# Altium schematic sheet HUB V1.3B.240322_TG.SchDoc
size A3
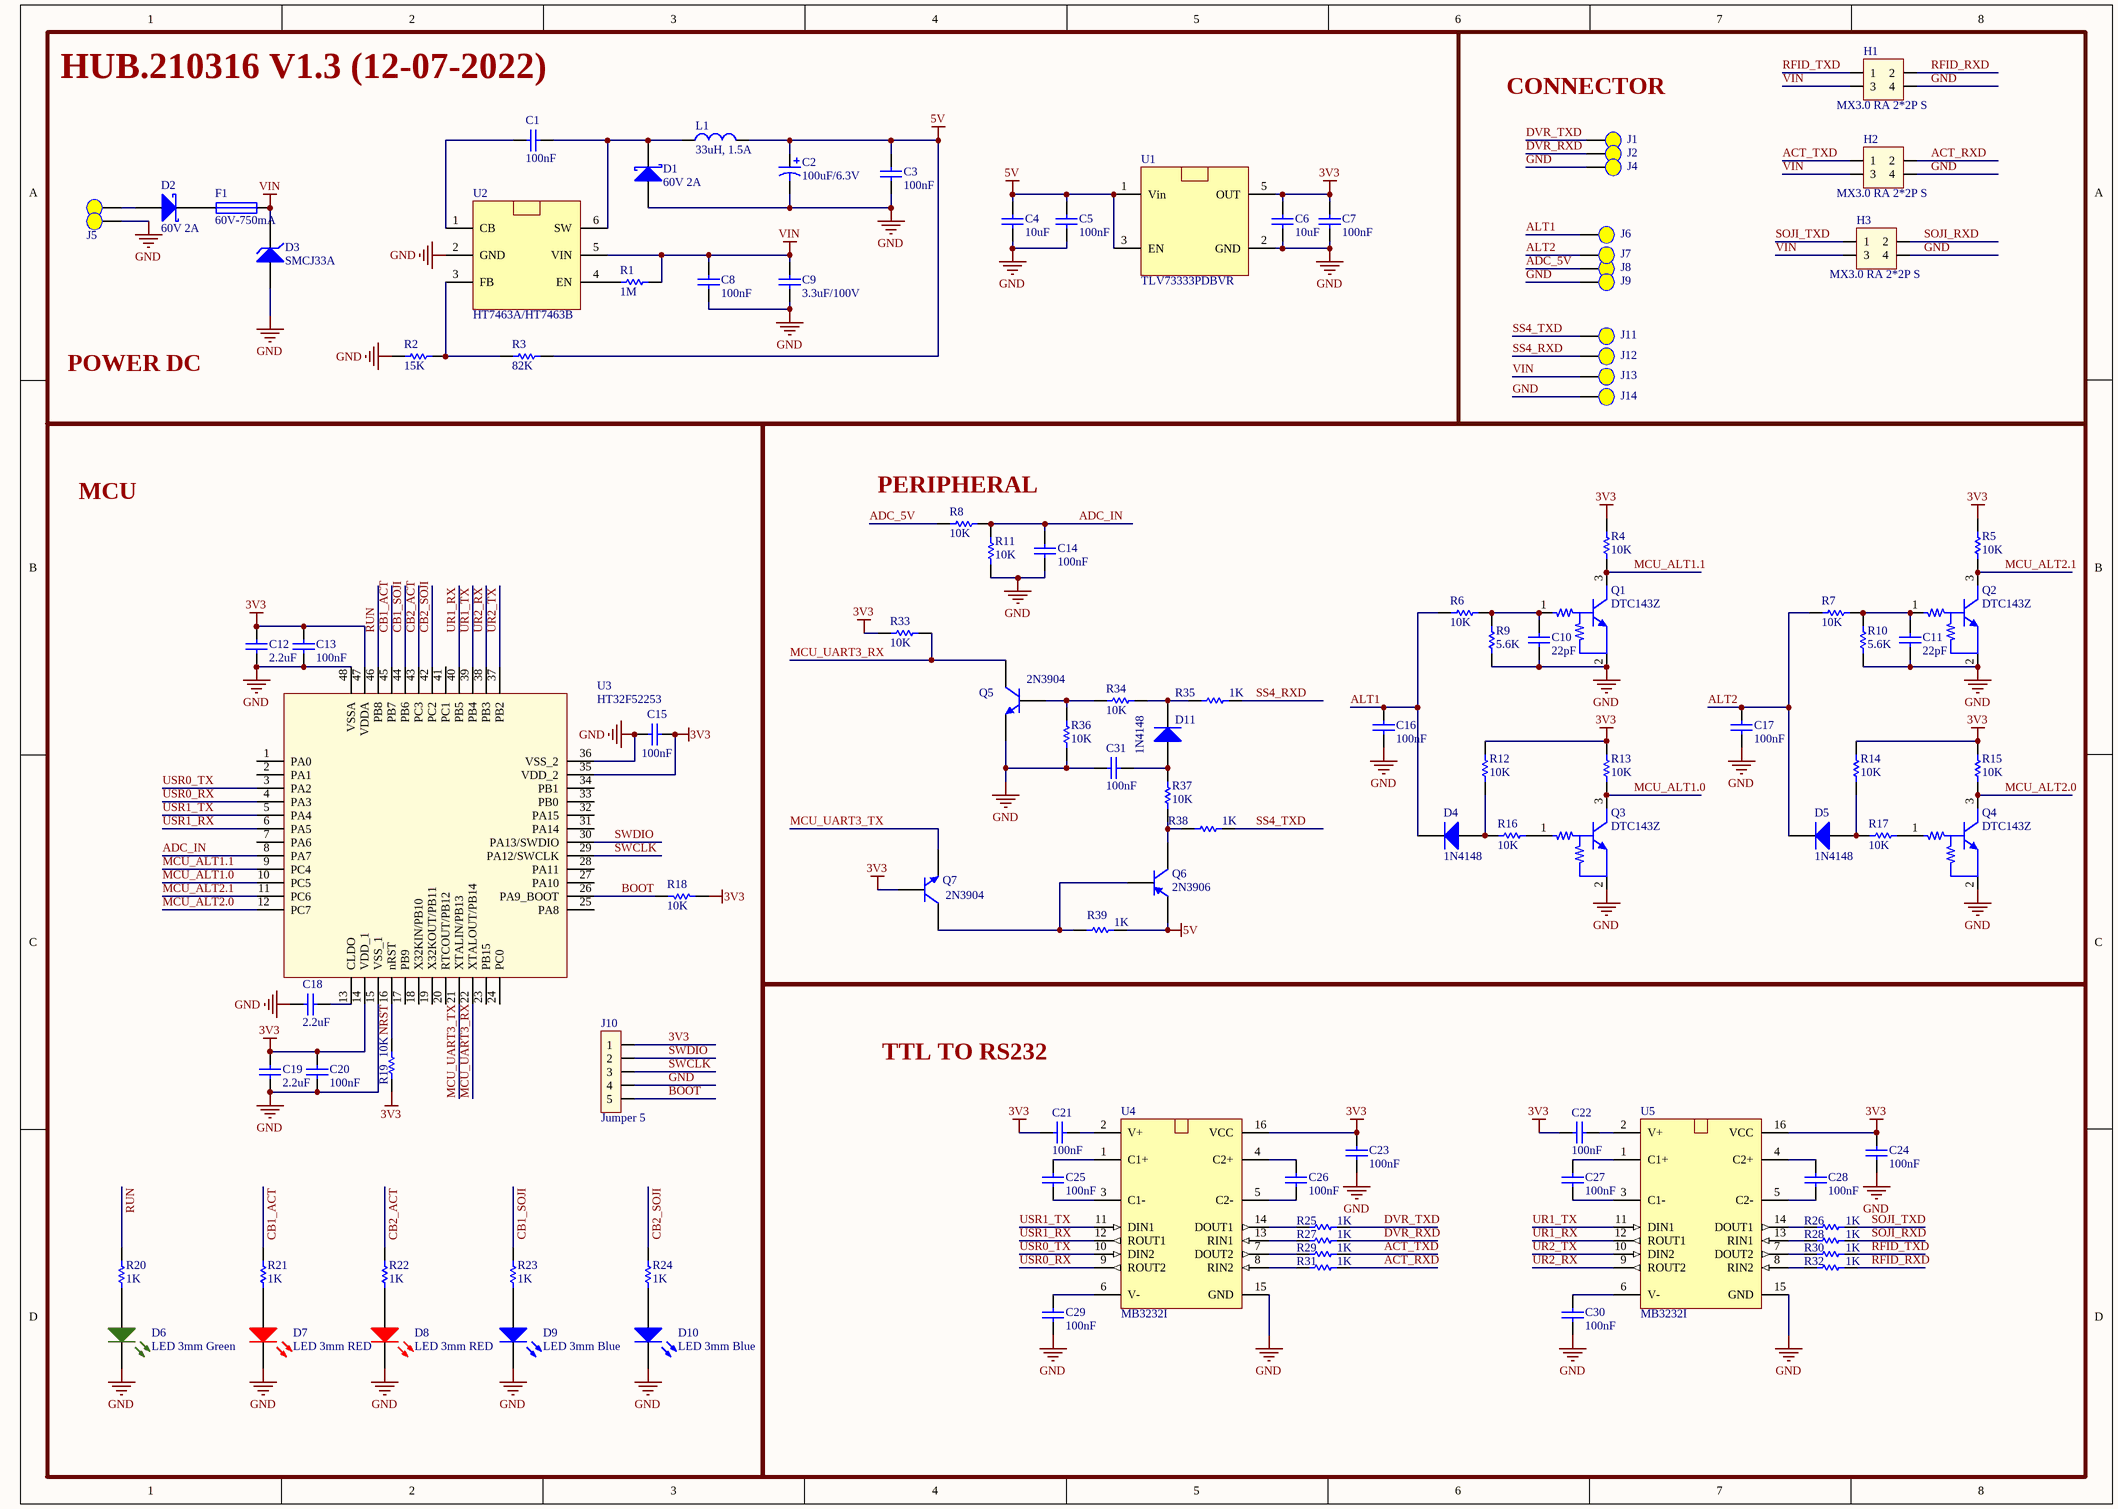
[diagram p0: HUB V1.3B.240322_TG.SchDoc]

## Parts
C1  100nF  [0603 - C]
C2  value 100uF/6.3V  [3528 - TANTALUM]  (hidden comment: 107B)
C3  100nF  [0603 - C]
C4  10uF  [0603 - C]
C5  100nF  [0603 - C]
C6  10uF  [0603 - C]
C7  100nF  [0603 - C]
C8  100nF  [0603 - C]
C9  3.3uF/100V  [1210 - C]
C10  22pF  [0603 - C]
C11  22pF  [0603 - C]
C12  2.2uF  [0603 - C]
C13  100nF  [0603 - C]
C14  100nF  [0603 - C]
C15  100nF  [0603 - C]
C16  100nF  [0603 - C]
C17  100nF  [0603 - C]
C18  2.2uF  [0603 - C]
C19  2.2uF  [0603 - C]
C20  100nF  [0603 - C]
C21  100nF  [0603 - C]
C22  100nF  [0603 - C]
C23  100nF  [0603 - C]
C24  100nF  [0603 - C]
C25  100nF  [0603 - C]
C26  100nF  [0603 - C]
C27  100nF  [0603 - C]
C28  100nF  [0603 - C]
C29  100nF  [0603 - C]
C30  100nF  [0603 - C]
C31  100nF  [0603 - C]
D1  60V 2A  [SOD-123]
D2  60V 2A  [SOD-123]
D3  SMCJ33A  [DIODE - SMC]
D4  1N4148  [SOD-123]
D5  1N4148  [SOD-123]
D6  LED 3mm Green  [LED-3mm GREEN]
D7  LED 3mm RED  [LED-3mm RED]
D8  LED 3mm RED  [LED-3mm RED]
D9  LED 3mm Blue  [LED-3mm BLUE]
D10  LED 3mm Blue  [LED-3mm BLUE]
D11  1N4148  [SOD-123]
F1  60V-750mA  [2016 - Fuse]
H1  MX3.0 RA 2*2P S  [43045-M3045-2x2-B]
H2  MX3.0 RA 2*2P S  [43045-M3045-2x2-B]
H3  MX3.0 RA 2*2P S  [43045-M3045-2x2-B]
J1  Test Point  [TP1]  (value not drawn)
J2  Test Point  [TP1]  (value not drawn)
J3  Test Point  [TP1]  (value not drawn)
J4  Test Point  [TP1]  (value not drawn)
J5  Test Point  [TP1]  (value not drawn)
J6  Test Point  [TP1]  (value not drawn)
J7  Test Point  [TP1]  (value not drawn)
J8  Test Point  [TP1]  (value not drawn)
J9  Test Point  [TP1]  (value not drawn)
J10  Jumper 5  [JP5 - 1]
J11  Test Point  [TP1]  (value not drawn)
J12  Test Point  [TP1]  (value not drawn)
J13  Test Point  [TP1]  (value not drawn)
J14  Test Point  [TP1]  (value not drawn)
L1  33uH, 1.5A  [INDUCTOR-5D28]
Q1  DTC143Z  [SOT23B]
Q2  DTC143Z  [SOT23B]
Q3  DTC143Z  [SOT23B]
Q4  DTC143Z  [SOT23B]
Q5  2N3904  [SOT23B]
Q6  2N3906  [SOT23B]
Q7  2N3904  [SOT23B]
R1  1M  [0603 - R]
R2  15K  [0603 - R]
R3  82K  [0603 - R]
R4  10K  [0603 - R]
R5  10K  [0603 - R]
R6  10K  [0603 - R]
R7  10K  [0603 - R]
R8  10K  [0603 - R]
R9  5.6K  [0603 - R]
R10  5.6K  [0603 - R]
R11  10K  [0603 - R]
R12  10K  [0603 - R]
R13  10K  [0603 - R]
R14  10K  [0603 - R]
R15  10K  [0603 - R]
R16  10K  [0603 - R]
R17  10K  [0603 - R]
R18  10K  [0603 - R]
R19  10K  [0603 - R]
R20  1K  [0603 - R]
R21  1K  [0603 - R]
R22  1K  [0603 - R]
R23  1K  [0603 - R]
R24  1K  [0603 - R]
R25  1K  [0603 - R]
R26  1K  [0603 - R]
R27  1K  [0603 - R]
R28  1K  [0603 - R]
R29  1K  [0603 - R]
R30  1K  [0603 - R]
R31  1K  [0603 - R]
R32  1K  [0603 - R]
R33  10K  [0603 - R]
R34  10K  [0603 - R]
R35  1K  [0603 - R]
R36  10K  [0603 - R]
R37  10K  [0603 - R]
R38  1K  [0603 - R]
R39  1K  [0603 - R]
U1  TLV73333PDBVR  [SOT23-5]
U2  HT7463A/HT7463B  [SOT23-6_L]
U3  HT32F52253  [LQFP48]
U4  MB3232I  [TSSOP16]
U5  MB3232I  [TSSOP16]

## Blocks framed on the sheet
HUB.210316 V1.3 (12-07-2022): C1-C9 D1-D3 F1 J3 J5 L1 R1-R3 U1 U2
CONNECTOR: H1-H3 J1 J2 J4 J6-J9 J11-J14
MCU: C12 C13 C15 C18-C20 D6-D10 J10 R18-R24 U3
PERIPHERAL: C10 C11 C14 C16 C17 C31 D4 D5 D11 Q1-Q7 R4-R17 R33-R39
TTL TO RS232: C21-C30 R25-R32 U4 U5

## Nets
3V3: C6.2 C7.2 C12.2 C13.1 C15.2 C19.2 C20.1 C21.2 C22.2 C23.1 C24.1 J10.1 Q7.1(B) R4.2 R5.2 R12.2 R13.2 R14.2 R15.2 R18.1 R19.1 R33.2 U1.5(OUT) U3.14(VDD_1) U3.35(VDD_2) U3.47(VDDA) U4.16(VCC) U5.16(VCC)
5V: C2.1 C3.2 C4.2 C5.2 L1.2 Q6.2(E) R3.2 R39.2 U1.1(Vin) U1.3(EN)
GND: C2.2 C3.1 C4.1 C5.1 C6.1 C7.1 C8.1 C9.1 C10.1 C11.1 C12.1 C13.2 C14.1 C15.1 C16.1 C17.1 C18.2 C19.1 C20.2 C23.2 C24.2 C29.2 C30.2 C31.1 D1.1(A) D3.1(A) D6.2(K) D7.2(K) D8.2(K) D9.2(K) D10.2(K) H1.4 H2.4 H3.4 J4.1 J5.1 J9.1 J10.4 J14.1 Q1.2(GND) Q2.2(GND) Q3.2(GND) Q4.2(GND) Q5.2(E) R2.2 R9.1 R10.1 R11.1 R36.2 U1.2(GND) U2.2(GND) U3.15(VSS_1) U3.36(VSS_2) U3.48(VSSA) U4.15(GND) U5.15(GND)
VIN: C8.2 C9.2 D3.2(K) F1.2 H1.3 H2.3 H3.3 J13.1 R1.1 U2.5(VIN)
ACT_RXD: H2.2 R29.2
ACT_TXD: H2.1 R27.2
ADC_5V: J8.1 R8.2
ADC_IN: C14.2 R8.1 R11.2 U3.8(PA7)
ALT1: C16.2 D4.2(K) J6.1 R6.1
ALT2: C17.2 D5.2(K) J7.1 R7.1
BOOT: J10.5 R18.2 U3.26(PA9_BOOT)
CB1_ACT: R21.1 U3.45(PB7)
CB1_SOJI: R23.1 U3.44(PB6)
CB2_ACT: R22.1 U3.43(PC3)
CB2_SOJI: R24.1 U3.42(PC2)
DVR_RXD: J2.1 R31.2
DVR_TXD: J1.1 R25.2
MCU_ALT1.0: Q3.3(OUT) R13.1 U3.10(PC5)
MCU_ALT1.1: Q1.3(OUT) R4.1 U3.9(PC4)
MCU_ALT2.0: Q4.3(OUT) R15.1 U3.12(PC7)
MCU_ALT2.1: Q2.3(OUT) R5.1 U3.11(PC6)
MCU_UART3_RX: Q5.3(C) R33.1 U3.22(XTALOUT/PB14)
MCU_UART3_TX: Q7.2(E) U3.21(XTALIN/PB13)
NRST: R19.2 U3.16(nRST)
RFID_RXD: H1.2 R32.2
RFID_TXD: H1.1 R30.2
RUN: R20.1 U3.46(PB8)
SOJI_RXD: H3.2 R28.2
SOJI_TXD: H3.1 R26.2
SS4_RXD: J12.1 R35.2
SS4_TXD: J11.1 R38.2
SWCLK: J10.3 U3.29(PA12/SWCLK)
SWDIO: J10.2 U3.30(PA13/SWDIO)
UR1_RX: U3.40(PB5) U5.12(ROUT1)
UR1_TX: U3.39(PB4) U5.11(DIN1)
UR2_RX: U3.38(PB3) U5.9(ROUT2)
UR2_TX: U3.37(PB2) U5.10(DIN2)
USR0_RX: U3.4(PA3) U4.9(ROUT2)
USR0_TX: U3.3(PA2) U4.10(DIN2)
USR1_RX: U3.6(PA5) U4.12(ROUT1)
USR1_TX: U3.5(PA4) U4.11(DIN1)
NetC1_1: C1.1 U2.1(CB)
NetC1_2: C1.2 D1.2(K) L1.1 U2.6(SW)
NetC10_2: C10.2 Q1.1(IN) R6.2 R9.2
NetC11_2: C11.2 Q2.1(IN) R7.2 R10.2
NetC18_1: C18.1 U3.13(CLDO)
NetC21_1: C21.1 U4.2(V+)
NetC22_1: C22.1 U5.2(V+)
NetC25_1: C25.1 U4.1(C1+)
NetC25_2: C25.2 U4.3(C1-)
NetC26_1: C26.1 U4.4(C2+)
NetC26_2: C26.2 U4.5(C2-)
NetC27_1: C27.1 U5.1(C1+)
NetC27_2: C27.2 U5.3(C1-)
NetC28_1: C28.1 U5.4(C2+)
NetC28_2: C28.2 U5.5(C2-)
NetC29_1: C29.1 U4.6(V-)
NetC30_1: C30.1 U5.6(V-)
NetC31_2: C31.2 D11.1(A) R37.1
NetD2_1: D2.1(A) J3.1
NetD2_2: D2.2(K) F1.1
NetD4_1: D4.1(A) R12.1 R16.2
NetD5_1: D5.1(A) R14.1 R17.2
NetD6_1: D6.1(A) R20.2
NetD7_1: D7.1(A) R21.2
NetD8_1: D8.1(A) R22.2
NetD9_1: D9.1(A) R23.2
NetD10_1: D10.1(A) R24.2
NetD11_2: D11.2(K) R34.1 R35.1
NetQ3_1: Q3.1(IN) R16.1
NetQ4_1: Q4.1(IN) R17.1
NetQ5_1: Q5.1(B) R34.2 R36.1
NetQ6_1: Q6.1(B) Q7.3(C) R39.1
NetQ6_3: Q6.3(C) R37.2 R38.1
NetR1_2: R1.2 U2.4(EN)
NetR2_1: R2.1 R3.1 U2.3(FB)
NetR25_1: R25.1 U4.14(DOUT1)
NetR26_1: R26.1 U5.14(DOUT1)
NetR27_1: R27.1 U4.7(DOUT2)
NetR28_1: R28.1 U5.13(RIN1)
NetR29_1: R29.1 U4.8(RIN2)
NetR30_1: R30.1 U5.7(DOUT2)
NetR31_1: R31.1 U4.13(RIN1)
NetR32_1: R32.1 U5.8(RIN2)

Not connected (* = marked no-connect by the designer): U1 4(NC); U3 1(PA0) 2(PA1) 7(PA6) 17(PB9) 18(X32KIN/PB10) 19(X32KOUT/PB11) 20(RTCOUT/PB12) 23(PB15) 24(PC0) 25(PA8) 27(PA10) 28(PA11) 31(PA14) 32(PA15) 33(PB0) 34(PB1) 41(PC1)

## Notes on the sheet
- POWER DC

## Library data of the parts
C1 C3 C8 C13 C15-C17 C20-C30 = Cap 0603 100nF: CAP CER 100nF 50V C0G/NP0 0603; MPN: CL10C104JB8NNNC; MFR: SAMSUNG; Company ID: VT_TỤ ĐIỆN_C0603 100nF; Voltage: 50V; Package: 0603; Size: C0603: 100nF; Value: 100nF
C2 = Cap Tan 3528 100uF/6.3V: CAP TANT 100UF 6.3V 10% 1411; MPN: T491B107K006AT; MFR: Kemet; Company ID: VT_CAP TAN 100uF 6.3V
C4 C6 = Cap 0603 10uF: CAP CER 10UF 16V X5R 0603; MPN: EMK107BBJ106MA-T; MFR: Yageo; Company ID: VT_CAP_C0603 10uF; Size: C0603: 10uF; Package: 0603; Value: 10uF
C5 C7 C14 C31 = Cap 0603 100nF: CAP CER 100nF 50V C0G/NP0 0603; MPN: CL10C104JB8NNNC; MFR: SAMSUNG; Company ID: VT_CAP_C0603 100nF; Voltage: 50V; Package: 0603; Size: C0603: 100nF; Value: 100nF
C9 = Cap 1210 3.3uF: CAP CER 3.3UF 100V X7S 1210; MPN: C3225X7S2A335M200AB; MFR: TDK Corporation; Company ID: VT_CAP_C1210 3.3uF 100V; Size: C1210: 3.3uF/100V; MPN2: 885012209071; Value: 3.3uF/100V
C10 C11 = Cap 0603 22pF: CAP CER 22PF 50V C0G/NP0 0603; MPN: CL10C220JB8NNNC; MFR: SAMSUNG; Company ID: VT_TỤ ĐIỆN_C0603 22pF; Size: C0603: 22pF; Value: 22pF
C12 C18 C19 = Cap 0603 2.2uF: CAP CER 2.2UF 50V X5R 0603; MFR: Murata Electronics; MPN: GRM188R61H225KE11J; Company ID: VT_CAP_C0603 2.2uF; Size: C0603: 2.2uF; Value: 2.2uF
D1 D2 = Diode PMEG6020ER: DIODE SCHOTTKY 60V 2A SOD123W; MPN: PMEG6020ER,115; MFR: NXP; Company ID: VT_DIODE_PMEG6020ER
D3 = SMCJ33A: TVS DIODE 33V 36.7V; MFR: Bourns Inc.; MPN: SMCJ33ABTR-ND; Company ID: VT_DIODE_ SMCJ33
D4 D5 D11 = Diode 1N4148: DIODE GEN PURP 100V 300MA SOD123; MPN: 1N4148W-7-F; MFR: DIODES; Company ID: VT_DIODE_1N4148W-7-F
D6 = LED 3mm Green: MFR: xx; Company ID: VT_LED_3mm_Green; MPN: xx
D7 D8 = LED 3mm RED: MFR: xx; Company ID: VT_LED_3mm_RED; MPN: xx
D9 D10 = LED 3mm Blue: MFR: China; MPN: xx; Company ID: VT_LED_3mm_Blue
F1 = Fuse 60V - 750mA: PTC RESET FUSE 60V 750MA 2016; MFR: Littelfuse Inc.; MPN: 2016L075/60MR; Company ID: VT_Fuse_60V - 750mA
H1-H3 = HD2x2 S: Micro-Fit 3.0™ Straight Header, 3.00mm Pitch, Dual Row, 4 Circuits; MPN: M3045-2x2-B; MFR: China; Company ID: VT_CONN_2*2 (M3045); MPN2: 43045-
J1-J9 J11-J14 = TP: 1mm - 1 layer
J10 = JP5: Jumper 5, 2.54mmx5
L1 = Inductor 33uH, 1.5A: FIXED IND 33UH 1.5A 286 MOHM SMD; MPN: SWPA6028S330MT; MFR: SunLord; Company ID: VT_IND_33uH/1.5A
Q1-Q4 = Transistor DTC143Z: TRANS PREBIAS NPN 200MW SMT3; MPN: DTC143ZKAT146; MFR: Rohm; Company ID: VT_TRANSISTOR_DTC143Z; MPN2: TDTC143Z,LM(T
Q5 Q7 = Transistor 2N3904: TRANS NPN 40V 0.2A SOT-23; MPN: MMBT3904; MFR: Fairchild; Company ID: VT_TRANSISTOR_3904
Q6 = Transistor 2N3906: TRANS PNP 40V 0.2A SOT23; MPN: MMBT3906; MFR: Fairchild; Company ID: VT_TRANSISTOR_3906
R1 = Res 0603 1M: RES SMD 1M OHM 1% 1/10W 0603; MFR: Yageo; MPN: RC0603FR-071ML; Company ID: VT_ĐIỆN TRỞ_R0603 1M; Value: 1M
R2 = Res 0603 15K: RES SMD 15K OHM 1% 1/10W 0603; MFR: Yageo; MPN: RC0603FR-0715KL; Company ID: VT_ĐIỆN TRỞ_R0603 15K; Size: R0603: 15K; Value: 15K
R3 = Res 0603 82K: RES SMD 82K OHM 1% 1/10W 0603; MFR: Yageo; MPN: RE0603FRE0782KL; Company ID: VT_RES_R0603 82K; Size: R0603: 82K; Value: 82K
R4-R8 R11-R17 R19 = Res 0603 10K: RES SMD 10K OHM 1% 1/10W 0603; MFR: Yageo; MPN: RC0603FR-0710KL; Company ID: VT_ĐIỆN TRỞ_R0603 10K; Size: R0603: 10K; Value: 10K
R9 R10 = Res 0603 5.6K: RES SMD 5.6K OHM 1% 1/10W 0603; MFR: Yageo; MPN: RC0603FR-075K6L; Company ID: VT_ĐIỆN TRỞ_R0603 5.6K; Size: R0603: 5.6K; Value: 5.6K
R18 R33 R34 R36 R37 = Res 0603 10K: RES SMD 10K OHM 1% 1/10W 0603; MFR: Yageo; MPN: RC0603FR-0710KL; Company ID: VT_RES_R0603 10K; Size: R0603: 10K; Value: 10K
R20-R32 = Res 0603 1K: RES SMD 1K OHM 1% 1/10W 0603; MFR: Yageo; MPN: RC0603FR-071KL; Company ID: VT_RES_R0603 1K; Size: R0603: 1K; Value: 1K
R35 R38 R39 = Res 0603 1K: RES SMD 1K OHM 1% 1/10W 0603; MFR: Yageo; MPN: RC0603FR-071KL; Company ID: VT_ĐIỆN TRỞ_R0603 1K; Value: 1K; Size: R0603: 1K
U1 = TLV73333PDBVR: IC REG LINEAR 3.3V 300MA SOT23-5; MFR: TI; Company ID: VT_IC_TLV73333; MPN: TLV73333PDBVR
U2 = HT7463A/HT7463B: 52V/600mA, 1.25MHz/550kHz / Asynchronous Step Down Converter; MFR: Holtek; Company ID: VT_IC_HT7463A/HT7463B; MPN: HT7463A/HT7463B
U3 = HT32F52253 48 LQFP-A: MFR: Holtek; Company ID: VT_IC_HT32F52253_48 LQFP-A; MPN: HT32F52253 48 LQFP-A
U4 U5 = MAX3232IPW: IC DRVR/RCVR MLTCH RS232 16TSSOP; MPN: MAX3232IPWR; MFR: TI; Company ID: VT_IC_MAX3232IPW